# Altium schematic sheet Hardware Achitecture.SchDoc
size A3; Date: 27.05.2014; DrawnBy: Author; Organization: BFH; Address1: Bern University of Applied Sciences; Address2: Engineering and Information Technology; Address3: Jlcoweg 1; Address4: CH-3400 Burgdorf; DocumentNumber: 1; Revision: 1.0; SheetNumber: 1; SheetTotal: 17; CurrentDate: 27.05.2014
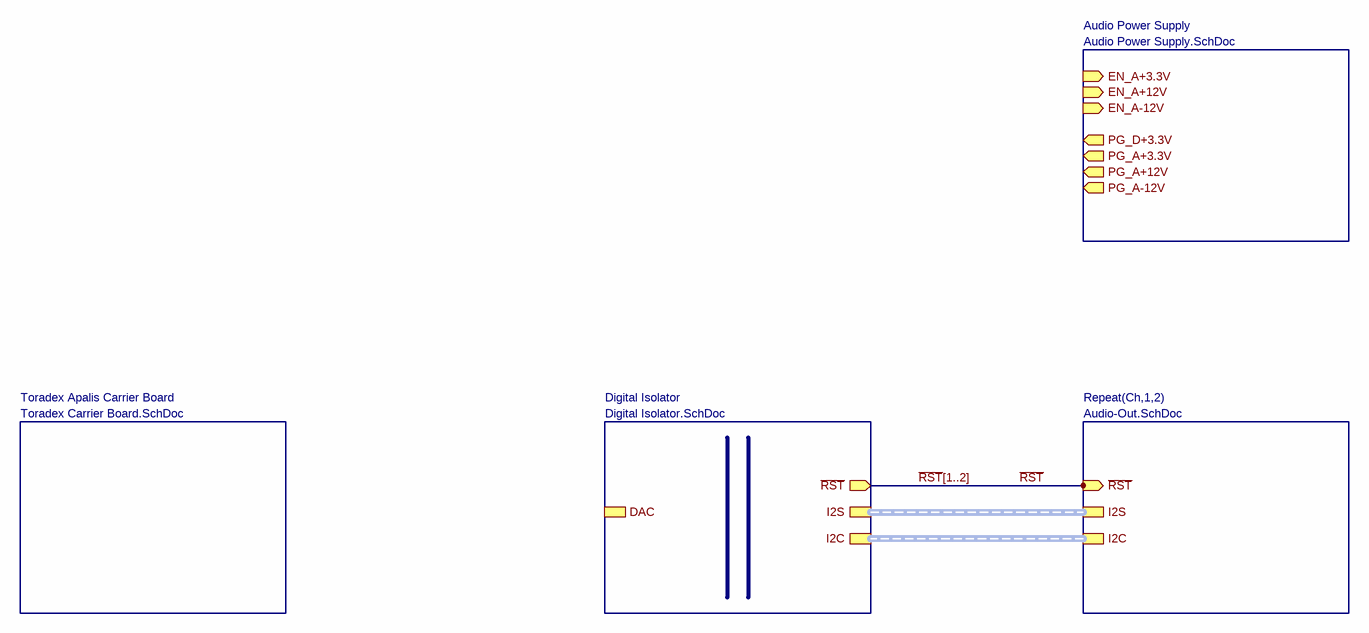
[diagram p0: Hardware Achitecture.SchDoc]

## Sub-sheets
Audio Power Supply = Audio Power Supply.SchDoc: PG_A-12V (out), EN_A+12V (in), PG_A+3.3V (out), EN_A-12V (in), PG_D+3.3V (out), EN_A+3.3V (in), PG_A+12V (out)
Digital Isolator = Digital Isolator.SchDoc: I2C (harness I2C), I2S (harness I2S), DAC (harness DAC), ~{RST} (out)
Repeat(Ch,1,2) = Audio-Out.SchDoc: ~{RST} (in), I2S (harness I2S), I2C (harness I2C)
Toradex Apalis Carrier Board = Toradex Carrier Board.SchDoc: no entries

## Nets
~{RST}: sheet Repeat(Ch,1,2)/~{RST}

## Buses and harness runs
bus ~{RST}[1..2] = sheet Digital Isolator/~{RST}
harness sheet Digital Isolator/I2C = sheet Repeat(Ch,1,2)/I2C
harness sheet Digital Isolator/I2S = sheet Repeat(Ch,1,2)/I2S

## Notes on the sheet
- Project:
- Size:
- Sheet:
- Title:
- A3
- of
- Drawn by:
- Revision:
- Date:
- Variant:
- File: